# EAGLE design led (EAGLE 7.1.0)
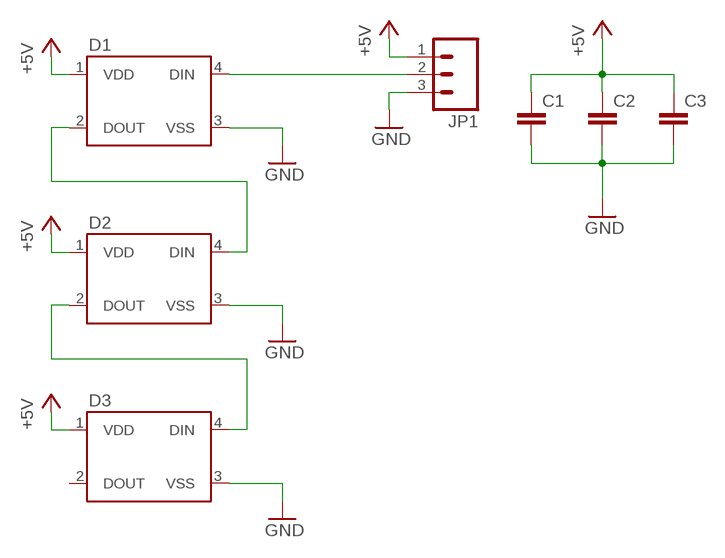
[diagram p0: schematic, sheet 1]

## Parts
C1  CAP1206  [1206]
C2  CAP1206  [1206]
C3  CAP1206  [1206]
D1  WS2812B  [WS2812B]
D2  WS2812B  [WS2812B]
D3  WS2812B  [WS2812B]
JP1  M03PTH  [1X03]

## Nets
+5V: C1.1 C2.1 C3.1 D1.1(VDD) D2.1(VDD) D3.1(VDD) JP1.1
GND: C1.2 C2.2 C3.2 D1.3(VSS) D2.3(VSS) D3.3(VSS) JP1.3
N$3: D1.2(DOUT) D2.4(DIN)
N$4: D2.2(DOUT) D3.4(DIN)
N$5: D1.4(DIN) JP1.2
Unconnected: D3.2(DOUT)

## Library data of the parts
C1-C3 = SparkFun-Capacitors:CAP: Capacitor Standard 0603 ceramic capacitor, and 0.1" leaded capacitor.
D1-D3 = SparkFun-LED:WS2812B: WS2812B - Intelligent control LED integrated light source Technical Specifications: Power Supply Voltage (VDD): 3.5 to 5.3 V Input Voltage (VI): -0.5 to VDD+0.5 V Operating Junction Temperature (Topt): -25°C to +80°C Storage Temperature Range (Tstg): -55°C to +150°C
JP1 = SparkFun-Connectors:M03: Header 3 Standard 3-pin 0.1" header. Use with straight break away headers (SKU : PRT-00116), right angle break away headers (PRT-00553), swiss pins (PRT-00743), machine pins (PRT-00117), and female headers (PRT-00115). Molex polarized connector foot print use with SKU : PRT-08232 with associated crimp pins and housings.

## Board
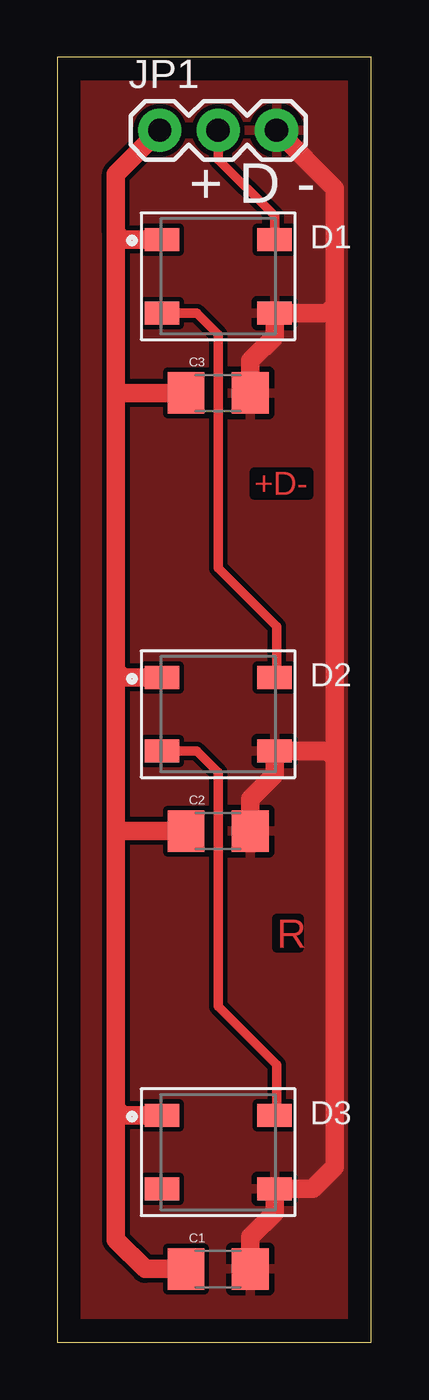
[diagram p1: board, top side]

Size 13.64 x 55.87 mm. Coordinates in mm from the lower left corner, seen from the top.
Outline: 0,0 13.64,0 13.64,55.87 0,55.87 0,0
Copper layers (1*16): Top 0.035mm / dielectric 1.5mm / Bottom 0.035mm
Design rules "default": minimum track width 10mil, minimum drill 24mil, track to track 8mil, track to pad 8mil, pad to pad 8mil, via to via 8mil, smd to smd 8mil, copper to edge 40mil, drill to drill 8mil, minimum pad ring 10mil, minimum via ring 8mil, stop-mask expansion 4mil, vias tented up to drill 0mil, thermal gap 10mil

### Footprints (pad centres in the part's own frame; a part is rotated, then mirrored left to right if it is on the bottom)
1206 = smd 1.6 x 1.8: 1 -1.4,0; 2 1.4,0
WS2812B = smd 1.5 x 1: 1 -2.45,1.6; 2 -2.45,-1.6; 3 2.45,-1.6; 4 2.45,1.6
1X03 = drill 1.016 pad 1.88: 1 0,0; 2 2.54,0; 3 5.08,0

### Placement (x,y rotation side)
C1  6.98,3.17 0 top
C2  6.98,22.22 0 top
C3  6.98,41.27 0 top
D1  6.98,46.36 0 top
D2  6.98,27.3 0 top
D3  6.98,8.26 0 top
JP1  4.45,52.71 0 top

### Tracks (layer width: path | path; a pad name or v marks a point on that pad's centre or on a via)
+5V
  Top 0.813: 2.54,48.26 2.54,41.27 | 2.54,41.27 2.54,29.21 | 2.54,29.21 2.54,22.22 | 2.54,22.22 2.54,10.16 | 2.54,10.16 2.54,4.45 3.81,3.17 C1.1 | D2.1 2.84,28.9 2.54,29.21 | D1.1 2.84,47.96 2.54,48.26 | C3.1 2.54,41.27 | D3.1 2.84,9.86 2.54,10.16 | C2.1 2.54,22.22 | 2.54,48.26 2.54,50.8 JP1.1
GND
  Top 0.254: 9.58,6.91 D3.3 | 8.66,22 C2.2 | 8.43,40.97 C3.2
  Top 0.813: C2.2 8.38,23.62 9.43,24.67 D2.3 11.76,25.7 12.07,25.4 | C1.2 8.38,4.58 9.43,5.62 D3.3 11.1,6.66 12.07,7.62 12.07,25.4 | C3.2 8.38,42.68 9.43,43.73 D1.3 11.73,44.76 12.07,45.09 | 12.07,45.09 12.07,50.16 JP1.3 | 12.07,25.4 12.07,45.09
  pour Top: -0.64,55.25 14.61,55.25 14.61,-0.64 -0.64,-0.64
N$3
  Top 0.406: D1.2 6.04,44.76 6.98,43.82 6.98,33.66 9.52,31.11 9.52,28.99 D2.4
N$4
  Top 0.406: D2.2 6.04,25.7 6.98,24.76 6.98,14.61 9.52,12.06 9.52,9.95 D3.4
N$5
  Top 0.406: JP1.2 6.98,51.44 9.43,48.98 D1.4

### Text on the board
Top: +D- | R
tNames: + D -